# Altium schematic sheet Driver4RackV3.9.SchDoc: Driver for rack
size C; PageSetup: Record=PageOptions|CenterHorizontal=True|CenterVertical=True|PrintScale=0.52|XCorrection=1.00|YCorrection=1.00|PrintKind=1|BorderSize=5000000|LeftOffset=0|BottomOffset=0|Orientation=2|PaperLength=2970|PaperWidth=2100|Scale=100|PaperSource=1|PrintQuality=-3|MediaType=1|DitherType=10|PaperKind=A4|PrintScaleMode=1
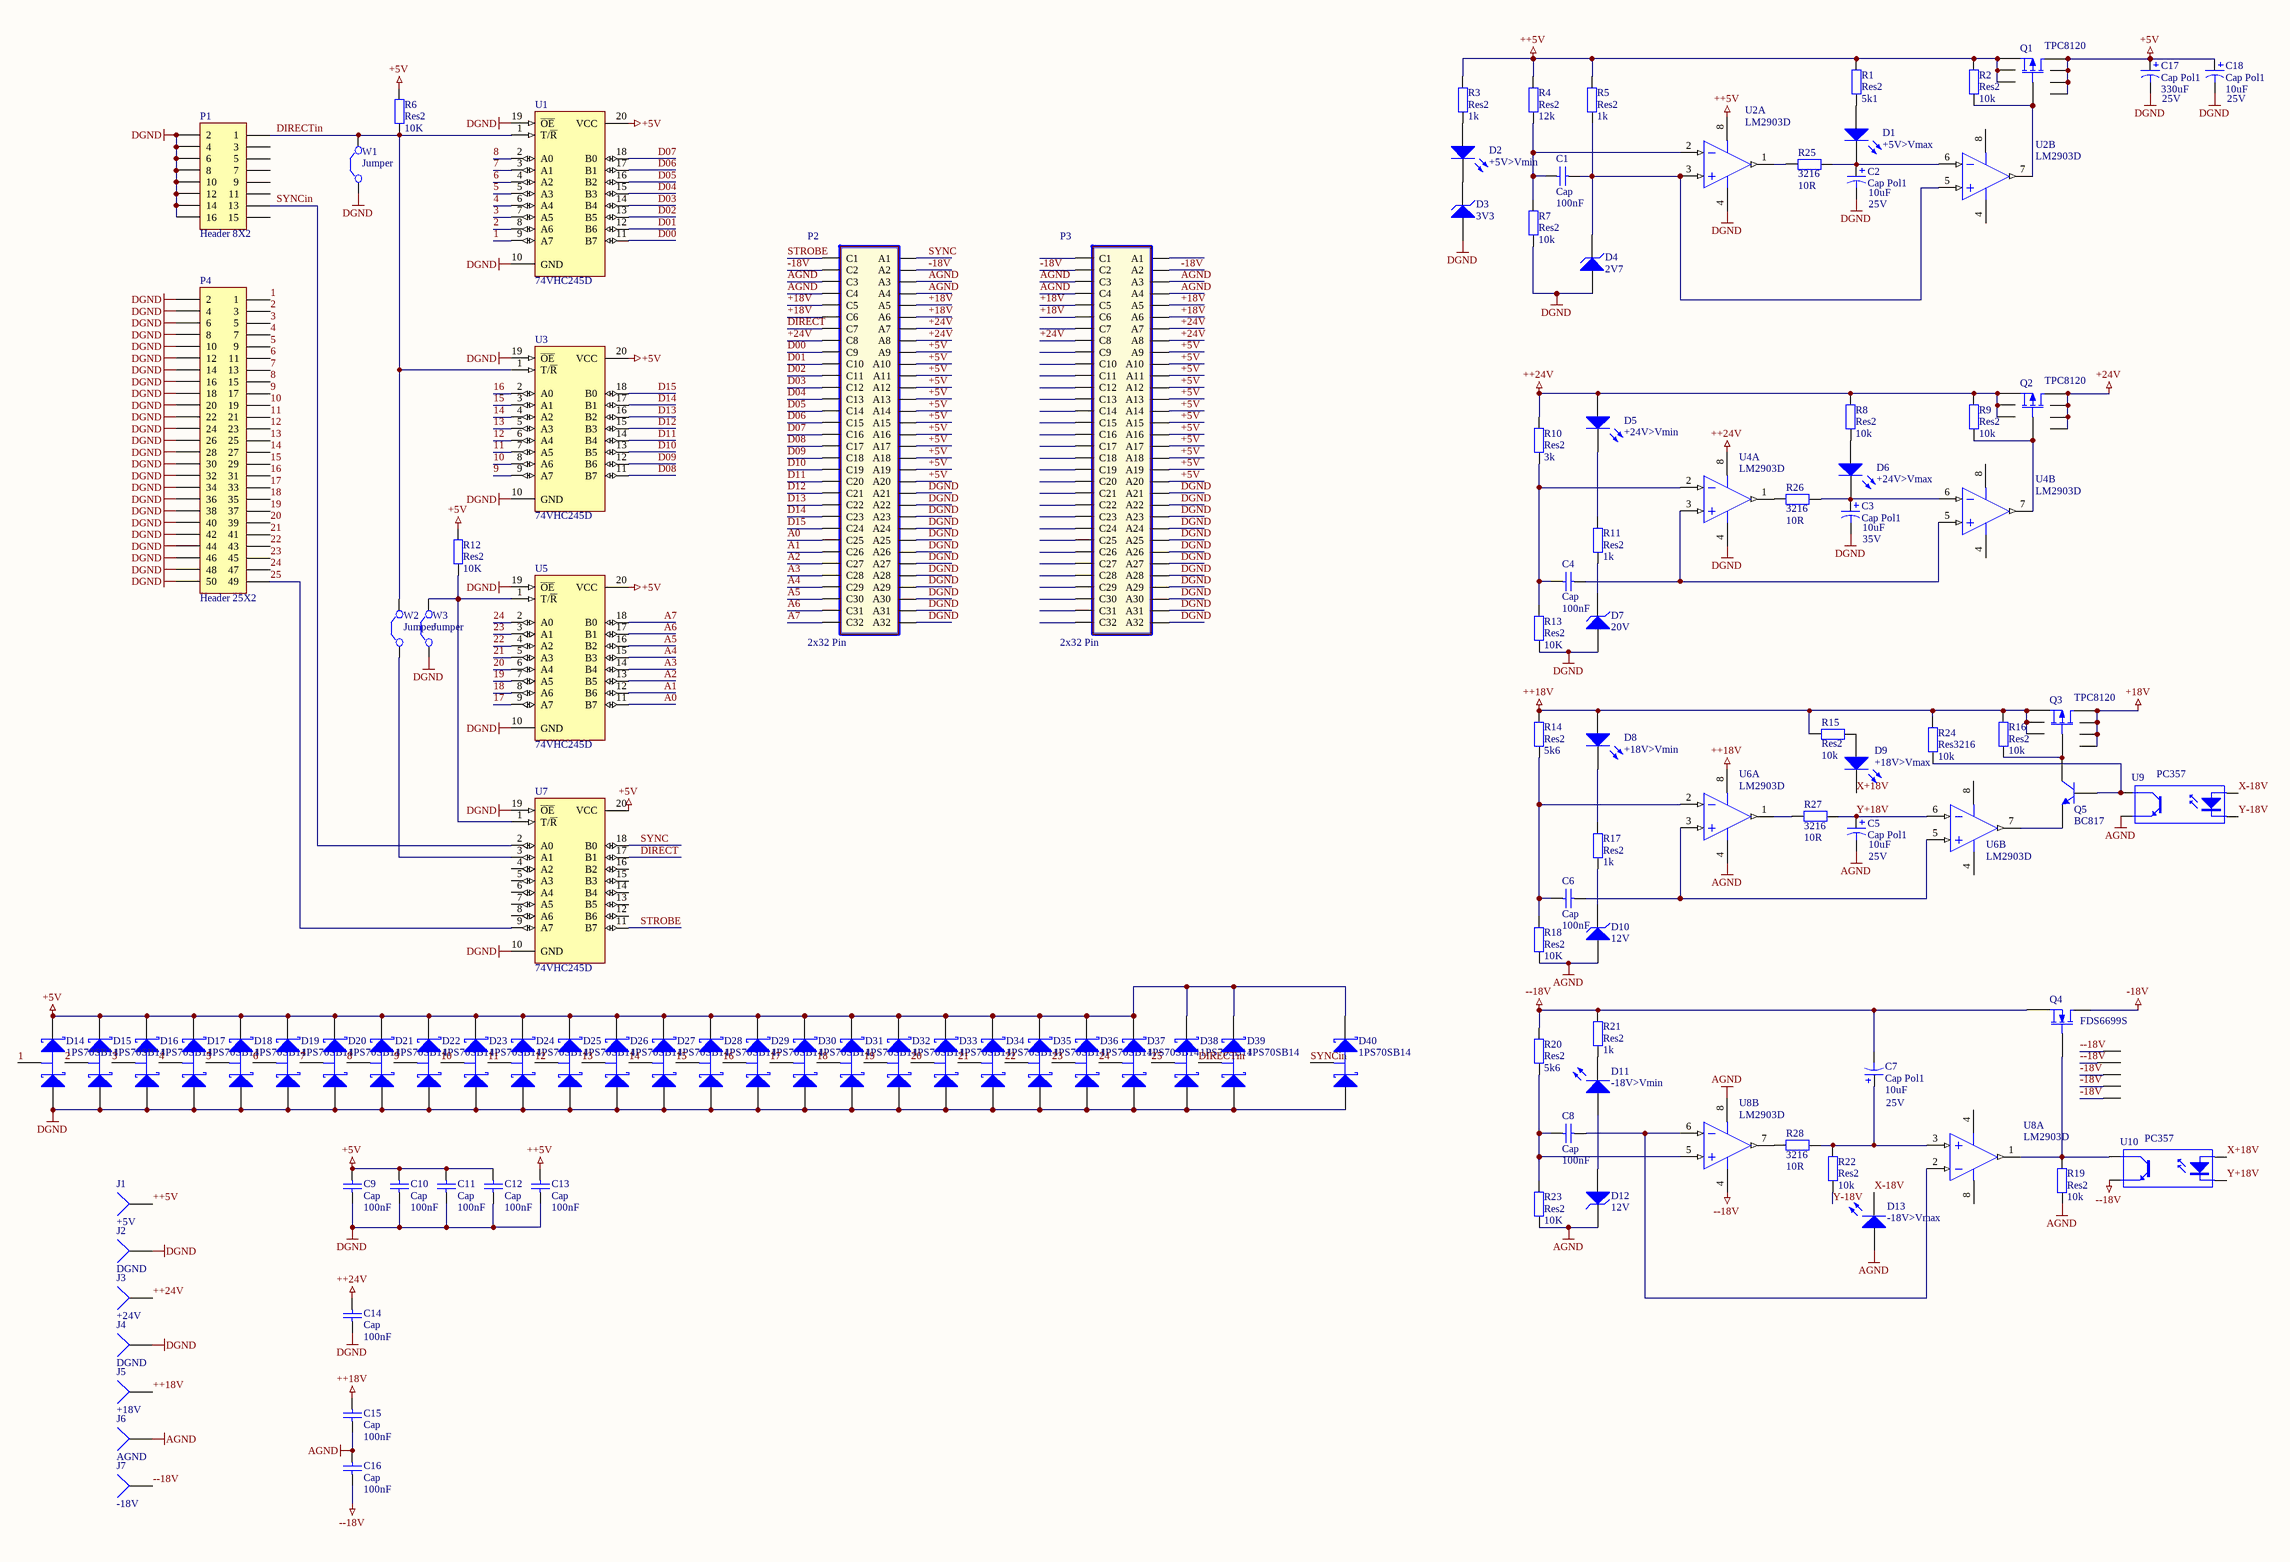
[diagram p0: Driver4RackV3.9.SchDoc]

## Parts
C1  Cap  value 100nF  [CAPC3216M]
C2  Cap Pol1  value 10uF  Voltage: 25V  [TC3528-1411]
C3  Cap Pol1  value 10uF  Voltage: 35V  [TC6032-2412]
C4  Cap  value 100nF  [CAPC3216M]
C5  Cap Pol1  value 10uF  Voltage: 25V  [TC3528-1411]
C6  Cap  value 100nF  [CAPC3216M]
C7  Cap Pol1  value 10uF  Voltage: 25V  [TC3528-1411]
C8  Cap  value 100nF  [CAPC3216M]
C9  Cap  value 100nF  [CAPC3216M]
C10  Cap  value 100nF  [CAPC3216M]
C11  Cap  value 100nF  [CAPC3216M]
C12  Cap  value 100nF  [CAPC3216M]
C13  Cap  value 100nF  [CAPC3216M]
C14  Cap  value 100nF  [CAPC3216M]
C15  Cap  value 100nF  [CAPC3216M]
C16  Cap  value 100nF  [CAPC3216M]
C17  Cap Pol1  value 330uF  Voltage: 25V  [ElkoSMD8]
C18  Cap Pol1  value 10uF  Voltage: 25V  [TC3528-1411]
D1  +5V>Vmax  [3.5X2.8X1.9]
D2  +5V>Vmin  [3.5X2.8X1.9]
D3  3V3  [sod80c]
D4  2V7  [sod80c]
D5  +24V>Vmin  [3.5X2.8X1.9]
D6  +24V>Vmax  [3.5X2.8X1.9]
D7  20V  [sod80c]
D8  +18V>Vmin  [3.5X2.8X1.9]
D9  +18V>Vmax  [3.5X2.8X1.9]
D10  12V  [sod80c]
D11  -18V>Vmin  [3.5X2.8X1.9]
D12  12V  [sod80c]
D13  -18V>Vmax  [3.5X2.8X1.9]
D14  1PS70SB14  [SOT323]
D15  1PS70SB14  [SOT323]
D16  1PS70SB14  [SOT323]
D17  1PS70SB14  [SOT323]
D18  1PS70SB14  [SOT323]
D19  1PS70SB14  [SOT323]
D20  1PS70SB14  [SOT323]
D21  1PS70SB14  [SOT323]
D22  1PS70SB14  [SOT323]
D23  1PS70SB14  [SOT323]
D24  1PS70SB14  [SOT323]
D25  1PS70SB14  [SOT323]
D26  1PS70SB14  [SOT323]
D27  1PS70SB14  [SOT323]
D28  1PS70SB14  [SOT323]
D29  1PS70SB14  [SOT323]
D30  1PS70SB14  [SOT323]
D31  1PS70SB14  [SOT323]
D32  1PS70SB14  [SOT323]
D33  1PS70SB14  [SOT323]
D34  1PS70SB14  [SOT323]
D35  1PS70SB14  [SOT323]
D36  1PS70SB14  [SOT323]
D37  1PS70SB14  [SOT323]
D38  1PS70SB14  [SOT323]
D39  1PS70SB14  [SOT323]
D40  1PS70SB14  [SOT323]
J1  +5V  [PIN1]
J2  DGND  [PIN1]
J3  +24V  [PIN1]
J4  DGND  [PIN1]
J5  +18V  [PIN1]
J6  AGND  [PIN1]
J7  -18V  [PIN1]
P1  Header 8X2  [HDR2X8]
P2  2x32 Pin  [0903164x922]
P3  2x32 Pin  [0903164x922]
P4  Header 25X2  [HDR2X25]
Q1  TPC8120  [2-6J1B]
Q2  TPC8120  [2-6J1B]
Q3  TPC8120  [2-6J1B]
Q4  FDS6699S  [SO-8_M]
Q5  BC817  [SOT-23B_N]
R1  Res2  value 5k1  [RESC3216M]
R2  Res2  value 10k  [RESC3216M]
R3  Res2  value 1k  [RESC3216M]
R4  Res2  value 12k  [RESC3216M]
R5  Res2  value 1k  [RESC3216M]
R6  Res2  value 10K  [RESC3216M]
R7  Res2  value 10k  [RESC3216M]
R8  Res2  value 10k  [RESC3216M]
R9  Res2  value 10k  [RESC3216M]
R10  Res2  value 3k  [RESC3216M]
R11  Res2  value 1k  [RESC3216M]
R12  Res2  value 10K  [RESC3216M]
R13  Res2  value 10K  [RESC3216M]
R14  Res2  value 5k6  [RESC3216M]
R15  Res2  value 10k  [RESC3216M]
R16  Res2  value 10k  [RESC3216M]
R17  Res2  value 1k  [RESC3216M]
R18  Res2  value 10K  [RESC3216M]
R19  Res2  value 10k  [RESC3216M]
R20  Res2  value 5k6  [RESC3216M]
R21  Res2  value 1k  [RESC3216M]
R22  Res2  value 10k  [RESC3216M]
R23  Res2  value 10K  [RESC3216M]
R24  Res3216  value 10k  [RESC3216M]
R25  3216  value 10R  [RESC3216M]
R26  3216  value 10R  [RESC3216M]
R27  3216  value 10R  [RESC3216M]
R28  3216  value 10R  [RESC3216M]
U1  74VHC245D  [DW020_N]
U2  LM2903D  [751-02_N]  (parts A,B of 2)
U3  74VHC245D  [DW020_N]
U4  LM2903D  [751-02_N]  (parts A,B of 2)
U5  74VHC245D  [DW020_N]
U6  LM2903D  [751-02_N]  (parts A,B of 2)
U7  74VHC245D  [DW020_N]
U8  LM2903D  [751-02_N]  (parts A,B of 2)
U9  PC357  [PC357NJ]
U10  PC357  [PC357NJ]
W1  Jumper  [RAD-0.1]
W2  Jumper  [RAD-0.1]
W3  Jumper  [RAD-0.1]

## Nets
+5V: C9.2 C10.2 C11.2 C12.2 C17.1 C18.1 D14.2(K) D15.2(K) D16.2(K) D17.2(K) D18.2(K) D19.2(K) D20.2(K) D21.2(K) D22.2(K) D23.2(K) D24.2(K) D25.2(K) D26.2(K) D27.2(K) D28.2(K) D29.2(K) D30.2(K) D31.2(K) D32.2(K) D33.2(K) D34.2(K) D35.2(K) D36.2(K) D37.2(K) D38.2(K) D39.2(K) D40.2(K) P2.A9 P2.A10 P2.A11 P2.A12 P2.A13 P2.A14 P2.A15 P2.A16 P2.A17 P2.A18 P2.A19 P2.A20 P3.A9 P3.A10 P3.A11 P3.A12 P3.A13 P3.A14 P3.A15 P3.A16 P3.A17 P3.A18 P3.A19 P3.A20 Q1.5(D) Q1.6(D) Q1.7(D) Q1.8(D) R6.2 R12.2 U1.20(VCC) U3.20(VCC) U5.20(VCC) U7.20(VCC)
+18V: P2.A5 P2.A6 P2.C5 P2.C6 P3.A5 P3.A6 P3.C5 P3.C6 Q3.5(D) Q3.6(D) Q3.7(D) Q3.8(D)
+24V: P2.A7 P2.A8 P2.C8 P3.A7 P3.A8 P3.C8 Q2.5(D) Q2.6(D) Q2.7(D) Q2.8(D)
++5V: C13.2 J1.1 Q1.1(S) Q1.2(S) Q1.3(S) R1.2 R2.2 R3.2 R4.2 R5.2 U2.8(V+)
++18V: C15.2 D8.1(A) J5.1 Q3.1(S) Q3.2(S) Q3.3(S) R14.2 R15.2 R16.2 R24.1 U6.8(V+)
++24V: C14.2 D5.1(A) J3.1 Q2.1(S) Q2.2(S) Q2.3(S) R8.2 R9.2 R10.2 U4.8(V+)
-18V: P2.A2 P2.C2 P3.A2 P3.C2 Q4.5(D) Q4.6(D) Q4.7(D) Q4.8(D)
--18V: C7.2 C16.1 J7.1 Q4.1(S) Q4.2(S) Q4.3(S) R20.2 R21.1 U8.4(GND) U10.3(E)
AGND: C5.2 C15.1 C16.2 D10.1(A) D12.2(K) D13.1(A) J6.1 P2.A3 P2.A4 P2.C3 P2.C4 P3.A3 P3.A4 P3.C3 P3.C4 R18.1 R19.1 R23.1 U6.4(GND) U8.8(V+) U9.3(E)
DGND: C2.2 C3.2 C9.1 C10.1 C11.1 C12.1 C13.1 C14.1 C17.2 C18.2 D3.1(A) D4.1(A) D7.1(A) D14.1(A) D15.1(A) D16.1(A) D17.1(A) D18.1(A) D19.1(A) D20.1(A) D21.1(A) D22.1(A) D23.1(A) D24.1(A) D25.1(A) D26.1(A) D27.1(A) D28.1(A) D29.1(A) D30.1(A) D31.1(A) D32.1(A) D33.1(A) D34.1(A) D35.1(A) D36.1(A) D37.1(A) D38.1(A) D39.1(A) D40.1(A) J2.1 J4.1 P1.2 P1.4 P1.6 P1.8 P1.10 P1.12 P1.14 P1.16 P2.A21 P2.A22 P2.A23 P2.A24 P2.A25 P2.A26 P2.A27 P2.A28 P2.A29 P2.A30 P2.A31 P2.A32 P3.A21 P3.A22 P3.A23 P3.A24 P3.A25 P3.A26 P3.A27 P3.A28 P3.A29 P3.A30 P3.A31 P3.A32 P4.2 P4.4 P4.6 P4.8 P4.10 P4.12 P4.14 P4.16 P4.18 P4.20 P4.22 P4.24 P4.26 P4.28 P4.30 P4.32 P4.34 P4.36 P4.38 P4.40 P4.42 P4.44 P4.46 P4.48 P4.50 R7.1 R13.1 U1.10(GND) U1.19(~{OE}) U2.4(GND) U3.10(GND) U3.19(~{OE}) U4.4(GND) U5.10(GND) U5.19(~{OE}) U7.10(GND) U7.19(~{OE}) W1.1(C1) W3.1(C1)
1: D14.3(C) P4.1 U1.9(A7)
2: D15.3(C) P4.3 U1.8(A6)
3: D16.3(C) P4.5 U1.7(A5)
4: D17.3(C) P4.7 U1.6(A4)
5: D18.3(C) P4.9 U1.5(A3)
6: D19.3(C) P4.11 U1.4(A2)
7: D20.3(C) P4.13 U1.3(A1)
8: D21.3(C) P4.15 U1.2(A0)
9: D22.3(C) P4.17 U3.9(A7)
10: D23.3(C) P4.19 U3.8(A6)
11: D24.3(C) P4.21 U3.7(A5)
12: D25.3(C) P4.23 U3.6(A4)
13: D26.3(C) P4.25 U3.5(A3)
14: D27.3(C) P4.27 U3.4(A2)
15: D28.3(C) P4.29 U3.3(A1)
16: D29.3(C) P4.31 U3.2(A0)
17: D30.3(C) P4.33 U5.9(A7)
18: D31.3(C) P4.35 U5.8(A6)
19: D32.3(C) P4.37 U5.7(A5)
20: D33.3(C) P4.39 U5.6(A4)
21: D34.3(C) P4.41 U5.5(A3)
22: D35.3(C) P4.43 U5.4(A2)
23: D36.3(C) P4.45 U5.3(A1)
24: D37.3(C) P4.47 U5.2(A0)
25: D38.3(C) P4.49 U7.9(A7)
A0: P2.C25 U5.11(B7)
A1: P2.C26 U5.12(B6)
A2: P2.C27 U5.13(B5)
A3: P2.C28 U5.14(B4)
A4: P2.C29 U5.15(B3)
A5: P2.C30 U5.16(B2)
A6: P2.C31 U5.17(B1)
A7: P2.C32 U5.18(B0)
D00: P2.C9 U1.11(B7)
D01: P2.C10 U1.12(B6)
D02: P2.C11 U1.13(B5)
D03: P2.C12 U1.14(B4)
D04: P2.C13 U1.15(B3)
D05: P2.C14 U1.16(B2)
D06: P2.C15 U1.17(B1)
D07: P2.C16 U1.18(B0)
D08: P2.C17 U3.11(B7)
D09: P2.C18 U3.12(B6)
D10: P2.C19 U3.13(B5)
D11: P2.C20 U3.14(B4)
D12: P2.C21 U3.15(B3)
D13: P2.C22 U3.16(B2)
D14: P2.C23 U3.17(B1)
D15: P2.C24 U3.18(B0)
DIRECT: P2.C7 U7.17(B1)
DIRECTin: D39.3(C) P1.1 R6.1 U1.1(T/~{R}) U3.1(T/~{R}) W1.2(C2) W2.2(C2)
STROBE: P2.C1 U7.11(B7)
SYNC: P2.A1 U7.18(B0)
SYNCin: D40.3(C) P1.13 U7.2(A0)
X+18V: D9.2(K) U10.1(A)
X-18V: D13.2(K) U9.1(A)
Y+18V: C5.1 R27.2 U6.6(IN-) U10.2(K)
Y-18V: R22.1 U9.2(K)
NetC1_1: C1.1 D4.2(K) R5.1 U2.3(IN+) U2.5(IN+)
NetC1_2: C1.2 R4.1 R7.2 U2.2(IN-)
NetC2_1: C2.1 D1.2(K) R25.2 U2.6(IN-)
NetC3_1: C3.1 D6.2(K) R26.2 U4.6(IN-)
NetC4_1: C4.1 U4.3(IN+) U4.5(IN+)
NetC4_2: C4.2 R10.1 R13.2 U4.2(IN-)
NetC6_1: C6.1 U6.3(IN+) U6.5(IN+)
NetC6_2: C6.2 R14.1 R18.2 U6.2(IN-)
NetC7_1: C7.1 R22.2 R28.2 U8.3(IN+)
NetC8_1: C8.1 U8.2(IN-) U8.6(IN-)
NetC8_2: C8.2 R20.1 R23.2 U8.5(IN+)
NetD1_1: D1.1(A) R1.1
NetD2_1: D2.1(A) R3.1
NetD2_2: D2.2(K) D3.2(K)
NetD5_2: D5.2(K) R11.2
NetD6_1: D6.1(A) R8.1
NetD7_2: D7.2(K) R11.1
NetD8_2: D8.2(K) R17.1
NetD9_1: D9.1(A) R15.1
NetD10_2: D10.2(K) R17.2
NetD11_1: D11.1(A) D12.1(A)
NetD11_2: D11.2(K) R21.2
NetQ1_4: Q1.4(G) R2.1 U2.7(OUT)
NetQ2_4: Q2.4(G) R9.1 U4.7(OUT)
NetQ3_4: Q3.4(G) Q5.3(C) R16.1
NetQ4_4: Q4.4(G) R19.2 U8.1(OUT) U10.4(C)
NetQ5_1: Q5.1(B) R24.2 U9.4(C)
NetQ5_2: Q5.2(E) U6.7(OUT)
NetR12_1: R12.1 U5.1(T/~{R}) U7.1(T/~{R}) W3.2(C2)
NetR25_1: R25.1 U2.1(OUT)
NetR26_1: R26.1 U4.1(OUT)
NetR27_1: R27.1 U6.1(OUT)
NetR28_1: R28.1 U8.7(OUT)
NetU7_3: U7.3(A1) W2.1(C1)

Not connected (* = marked no-connect by the designer): P1 3 5 7 9 11 15; P3 A1 C1 C7 C9 C10 C11 C12 C13 C14 C15 C16 C17 C18 C19 C20 C21 C22 C23 C24 C25 C26 C27 C28 C29 C30 C31 C32; U7 4(A2) 5(A3) 6(A4) 7(A5) 8(A6) 12(B6) 13(B5) 14(B4) 15(B3) 16(B2)

## Library data of the parts
C1 C4 C6 C8-C16 = Cap: Capacitor; Voltage: 50V; Published: 8-Jun-2000; LatestRevisionDate: 17-Jul-2002; LatestRevisionNote: Re-released for DXP Platform.; Publisher: Altium Limited
C2 C3 C5 C7 C17 C18 = Cap Pol1: Polarized Capacitor (Radial); Published: 8-Jun-2000; LatestRevisionDate: 17-Jul-2002; LatestRevisionNote: Re-released for DXP Platform.; Publisher: Altium Limited
  C17 C18: PackageReference: RB7.6-15; PackageDescription: Polarized Capacitor (Radial); 2 Leads
D1 D6 D9 D13 = LED1: Typical RED GaAs LED; colour: blue; Published: 8-Jun-2000; LatestRevisionDate: 08-Jul-2005; LatestRevisionNote: Mech Layer 1 removed.; PackageReference: LED-1; Publisher: Altium Limited; PackageDescription: LED; 2 Leads
D2 = LED3: Typical green SiC LED; Published: 8-Jun-2000; LatestRevisionDate: 17-Dec-2003; LatestRevisionNote: PCB Footprint replaced.; DatasheetVersion: 16-Apr-2002; PackageVersion: 16-Apr-2002; PackageReference: 3.5X2.8X1.9; Publisher: Altium Limited; PackageDescription: SM LED; 2 C-Bend Leads; Body 3.5 x 2.8 x 1.9 mm, inc leads (LxWxH typ); colour: green
D3 D4 D7 D10 D12 = D Zener: Zener Diode; Published: 8-Jun-2000; LatestRevisionDate: 17-Jul-2002; LatestRevisionNote: Re-released for DXP Platform.; PackageReference: DIODE-0.7; Publisher: Altium Limited; PackageDescription: Diode, Thru-Hole; 2 Leads; 0.7 in Pin Spacing
D5 D8 D11 = LED1: Typical green GaAs LED; Published: 8-Jun-2000; LatestRevisionDate: 08-Jul-2005; LatestRevisionNote: Mech Layer 1 removed.; PackageReference: LED-1; Publisher: Altium Limited; PackageDescription: LED; 2 Leads; colour: green
D14-D40 = 1PS70SB14: Schottky Barrier Double Diode; Published: 17-Sep-2003; DatasheetDocument: 26-Apr-1999; PackageDocument: Apr-1999; PackageReference: SOT323; Publisher: Altium Limited
J1-J7 = Socket: LatestRevisionDate: 17-Jul-2002; LatestRevisionNote: Re-released for DXP Platform.; Publisher: Altium Limited
P1 = Header 8X2: Header, 8-Pin, Dual row; LatestRevisionDate: 17-Jul-2002; LatestRevisionNote: Re-released for DXP Platform.; Publisher: Altium Limited
P2 P3 = 64 Pin Header: DIN 41612
P4 = Header 25X2: Header, 25-Pin, Dual row; LatestRevisionDate: 17-Jul-2002; LatestRevisionNote: Re-released for DXP Platform.; Publisher: Altium Limited
Q1-Q3 = TPC8120: Mosfet P
Q4 = MOSFET-N: N-Channel MOSFET; Published: 8-Jun-2000; LatestRevisionDate: 17-Jul-2002; LatestRevisionNote: Re-released for DXP Platform.; PackageVersion: 1995/1996; PackageReference: E3; Publisher: Altium Limited; PackageDescription: TO, Flat Index; 3 In-Line, Axial Leads; Body Dia. 4.6mm; Lead Dia. 0.5 mm (max)
Q5 = QNPN: NPN Bipolar Transistor; Published: 8-Jun-2000; LatestRevisionDate: 29-May-2009; LatestRevisionNote: IPC-7351 Footprint Added.; PackageVersion: Aug-1999; PackageReference: SOT-23B; Publisher: Altium Limited; PackageDescription: 3-Pin SOT-23 Package 0.95 mm Pitch, 2.4 mm Lead Span
R1-R23 = Res2: Resistor; Published: 8-Jun-2000; LatestRevisionDate: 17-Jul-2002; LatestRevisionNote: Re-released for DXP Platform.; Publisher: Altium Limited
  R1-R5 R7-R11 R13-R23: PackageReference: AXIAL-0.4; PackageDescription: Axial Device, Thru-Hole; 2 Leads; 0.4 in Pin Spacing
R24-R28 = Resistor3216: Resistor; Published: 8-Jun-2000; LatestRevisionDate: 17-Jul-2002; LatestRevisionNote: Re-released for DXP Platform.; PackageReference: AXIAL-0.4; Publisher: Altium Limited; PackageDescription: Axial Device, Thru-Hole; 2 Leads; 0.4 in Pin Spacing
U1 U3 U5 U7 = SN74HC245DW: Octal Bus Transceiver with 3-State Outputs; Published: 8-Jun-2000; LatestRevisionDate: 13-Apr-2006; LatestRevisionNote: IPC-7351 Footprint Added.; DatasheetVersion: May-1997; PackageVersion: Mar-2000; PackageReference: DW020; Publisher: Altium Limited; PackageDescription: 20-Pin Plastic Small Outline Integrated Circuit 1.27 mm Pitch; Code_JEDEC: MS-013; Code_IPC: SOIC127P1030-20; ComponentLink1Description: Manufacturer Link; ComponentLink1URL: http://www.ti.com/; ComponentLink2Description: Datasheet; ComponentLink2URL: http://www-s.ti.com/sc/ds/sn74hc245.pdf
U2 U4 U6 U8 = LM2903D: Dual Comparator; Published: 17-Jul-2002; LatestRevisionDate: 13-Apr-2006; LatestRevisionNote: IPC-7351 Footprint Added.; DatasheetVersion: 1988; PackageReference: 751-02; Publisher: Altium Limited; PackageDescription: 8-Pin Small Outline Integrated Circuit 1.27 mm Pitch; Code_JEDEC: MS-012-AA; Code_IPC: SOIC127P600-8; ComponentLink1Description: Manufacturer Link; ComponentLink1URL: http://www.onsemi.com/site/products/taxonomy/0,4438,133,00.html
U9 U10 = Optoisolator1: 4-Pin Phototransistor Optocoupler; Published: 24-Mar-1999; LatestRevisionDate: 04-Mar-2005; LatestRevisionNote: Sch pins 3 & 4 Swapped.; DatasheetVersion: Nov-2003; PackageReference: DIP-4; Publisher: Altium Limited
W1-W3 = Jumper: Jumper Wire; Published: 24-Mar-1999; LatestRevisionDate: 17-Jul-2002; LatestRevisionNote: Re-released for DXP Platform.; PackageReference: RAD-0.2; Publisher: Altium Limited; PackageDescription: Radial Cap, Thru-Hole; 2 Leads; 0.2 in Pin Spacing